# Altium project B152AA.PrjPcb
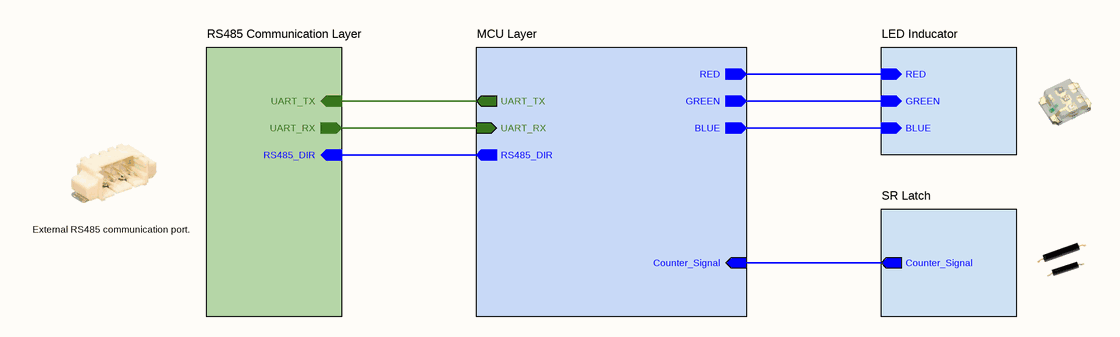
[diagram p0: Block_Diagram.SchDoc]
Address1_: Buyuk Kayacik Mah. 4. OSB; Address2_: 103. Cad. No : 12; Address3_: Selcuklu / Konya; Address4_: Türkiye; Copyright_: Copyright 2022 STF Tarim (Commercial Secret); Customer_: STF Irrigation; Engineer_: Gunce Akkoyun; Git_Repo_Address_: www.github.com/akkoyun/B152AA; Module_ID_: B152AA; Organization_: STF Res-Dev; Product_Desc_: P101DA; Product_ID_: P101DA; Revision_: 00.00.01; Version_: R1
5 sheets, 52 parts. Net scope: hierarchical (ports join the sheet entries above them; power ports are global).
Board file: B152AA.PcbDoc
Sheets:
  Block_Diagram.SchDoc
    RS485 Communication Layer = RS485 Communication Layer.SchDoc
    MCU Layer = MicroController.SchDoc
    SR Latch = SR Latch.SchDoc
    LED Inducator = LED Inducator.SchDoc

## Sheet Block_Diagram.SchDoc: B152AA Block Diagram
size 292 x 193 mm; SheetNumber: 1; SheetTotal: 5

### Sub-sheets
LED Inducator = LED Inducator.SchDoc: RED (in), BLUE (in), GREEN (in)
MCU Layer = MicroController.SchDoc: UART_TX (out), UART_RX (in), Counter_Signal (in), RS485_DIR (out), GREEN (out), RED (out), BLUE (out)
RS485 Communication Layer = RS485 Communication Layer.SchDoc: RS485_DIR (in), UART_RX (out), UART_TX (in)
SR Latch = SR Latch.SchDoc: Counter_Signal (out)

### Nets
BLUE: sheet MCU Layer/BLUE, sheet LED Inducator/BLUE
Counter_Signal: sheet MCU Layer/Counter_Signal, sheet SR Latch/Counter_Signal
GREEN: sheet MCU Layer/GREEN, sheet LED Inducator/GREEN
RED: sheet MCU Layer/RED, sheet LED Inducator/RED
RS485_DIR: sheet RS485 Communication Layer/RS485_DIR, sheet MCU Layer/RS485_DIR
UART_RX: sheet RS485 Communication Layer/UART_RX, sheet MCU Layer/UART_RX
UART_TX: sheet RS485 Communication Layer/UART_TX, sheet MCU Layer/UART_TX

### Notes on the sheet
- External RS485 communication port.
- © 2021 All rights reserved.
  This document may not, in whole or in part, be copied, photocopied, reproduced, translated or converted to any electronic or machine readable from without prior written permission of Mehmet Günce Akkoyun.
  Engineer contact : akkoyun@me.com
- Property of
- Engineer :
- Date :
- Size :
- A4
- Time :
- Project :
- Page :
- /
- Customer :
- Product ID :
- Module ID :
- Version :
- File :
- Revision :

## Sheet RS485 Communication Layer.SchDoc: RS485 Communication Layer
size 292 x 193 mm; SheetNumber: 2; SheetTotal: 5
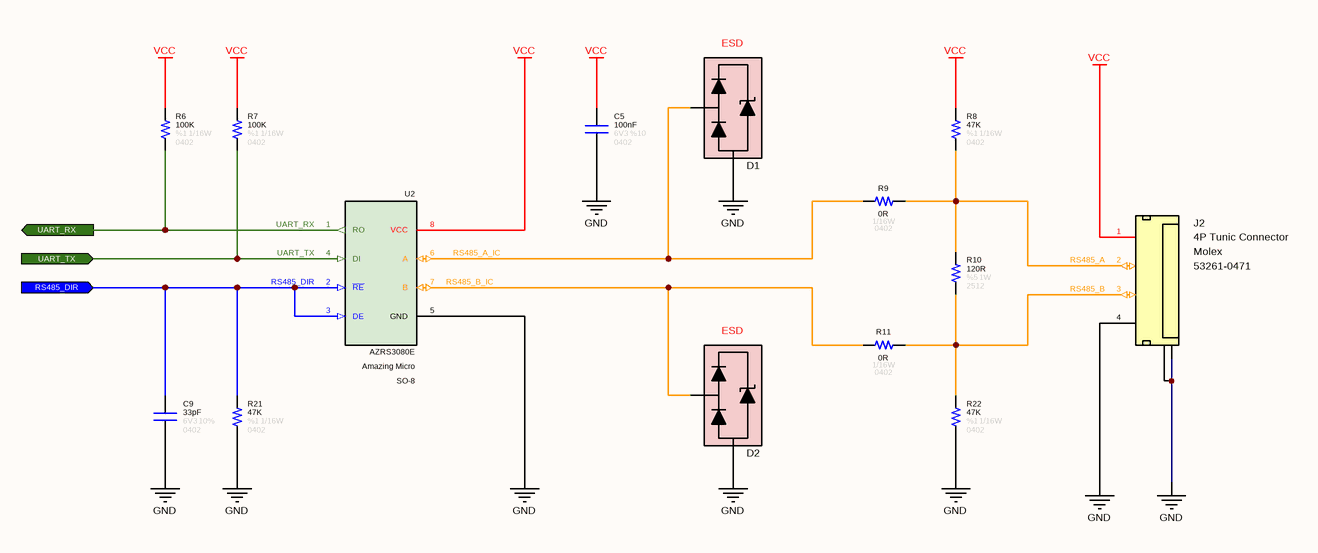
[diagram p1: RS485 Communication Layer.SchDoc]

### Parts
C5  value 100nF  Tolerance: %10  Voltage: 6V3  Case: 0402  [CAPACITOR_0402]  (hidden comment: Capacitor - 100nF [0402] (Ceramic))
C9  value 33pF  Tolerance: 10%  Case: 0402  Voltage: 6V3  [CAPACITOR_0402]  (hidden comment: Capacitor - 33pF [0402] (Ceramic))
D1  0402ESDA-MLP1  [ESD_0402]  (value not drawn)
D2  0402ESDA-MLP1  [ESD_0402]  (value not drawn)
J2  Manufacturer Name: Molex  Manufacturer Part Number: 53261-0471  [Connector_Tunic 4P]  (hidden comment: 4P SMD Tunic Connector)
R6  value 100K  Tolerance: %1  Case: 0402  Power: 1/16W  [RESISTOR_0402]  (hidden comment: 100K - 0402 - %1 - 1/16W)
R7  value 100K  Tolerance: %1  Case: 0402  Power: 1/16W  [RESISTOR_0402]  (hidden comment: 100K - 0402 - %1 - 1/16W)
R8  value 47K  Tolerance: %1  Case: 0402  Power: 1/16W  [RESISTOR_0402]  (hidden comment: 47K - 0402 - %1 - 1/16W)
R9  value 0R  Case: 0402  Power: 1/16W  [RESISTOR_0402]  (hidden comment: 0R - 0402 - %1 - 1/16W)
R10  value 120R  Tolerance: %5  Case: 2512  Power: 1W  [RESISTOR_2512]  (hidden comment: 120R - 2512 - %5 - 1W)
R11  value 0R  Case: 0402  Power: 1/16W  [RESISTOR_0402]  (hidden comment: 0R - 0402 - %1 - 1/16W)
R21  value 47K  Tolerance: %1  Case: 0402  Power: 1/16W  [RESISTOR_0402]  (hidden comment: 47K - 0402 - %1 - 1/16W)
R22  value 47K  Tolerance: %1  Case: 0402  Power: 1/16W  [RESISTOR_0402]  (hidden comment: 47K - 0402 - %1 - 1/16W)
U2  Case: SO-8  Manufacturer Part Number: AZRS3080E  Manufacturer Name: Amazing Micro  [SOP-8L (AZRS3080E)]  (hidden comment: RS485 Modulator)

### Ports
RS485_DIR (in), UART_RX (out), UART_TX (in)

### Nets
GND: C5.1 C9.1 D1.2(GND) D2.2(GND) J2.4(Pin-4) J2.5(GND) J2.6(GND) R21.1 R22.1 U2.5(GND)
VCC: C5.2 J2.1(Pin-1) R6.2 R7.2 R8.2 U2.8(VCC)
RS485_A: J2.2(Pin-2) R8.1 R9.1 R10.2
RS485_A_IC: D1.1(I/O) R9.2 U2.6(A)
RS485_B: J2.3(Pin-3) R10.1 R11.1 R22.2
RS485_B_IC: D2.1(I/O) R11.2 U2.7(B)
RS485_DIR: C9.2 R21.2 U2.2(~{RE}) U2.3(DE) ; port RS485_DIR
UART_RX: R6.1 U2.1(RO) ; port UART_RX
UART_TX: R7.1 U2.4(DI) ; port UART_TX

### Notes on the sheet
- © 2021 All rights reserved.
  This document may not, in whole or in part, be copied, photocopied, reproduced, translated or converted to any electronic or machine readable from without prior written permission of Mehmet Günce Akkoyun.
  Engineer contact : akkoyun@me.com
- Property of
- Engineer :
- Date :
- Size :
- A4
- Time :
- Project :
- Page :
- /
- Customer :
- Product ID :
- Module ID :
- Version :
- File :
- Revision :
- (in symbol Connector - Mini Tunic 4P (1.25)) 4P Tunic Connector
- (in symbol Diode - TPD1E05U06DPYR) ESD

### Library data of the parts
C5 = Capacitor - 100nF [0402-6V3]: Capacitor - 100nF [0402-6V3] (Ceramic); Manufacturer Name: AVX; Manufacturer Part Number: 04026D104KAT4A; ComponentLink1Description: Mouser; ComponentLink1URL: https://www.mouser.com.tr/ProductDetail/AVX/04026D104KAT4A?qs=sGAEpiMZZMs0AnBnWHyRQPg4iYkCw7IMED%2F4kpqgf7w%3D; ComponentLink2Description: DataSheet; ComponentLink2URL: https://www.mouser.com.tr/datasheet/2/40/cx5r-776519.pdf
C9 = Capacitor - 33pF [0402-6V3]: Manufacturer Name: Kemet; Manufacturer Part Number: C0402C330J9RACAUTO; ComponentLink1Description: DataSheet; ComponentLink1URL: https://api.kemet.com/component-edge/download/datasheet/C0402C330J9RACAUTO.pdf; ComponentLink2Description: Mouser; ComponentLink2URL: https://www.mouser.com/Search/Refine.aspx?Keyword=80-C0402C330J9RAUTO
D1 D2 = Diode - TPD1E05U06DPYR: SUPPRESSOR ESD 30VDC 0402 HFREE; Manufacturer Name: Eaton; Breakdown Voltage: 30V; Capacitance: 0.15pF; Manufacturer Part Number: 0402ESDA-MLP1; Case: 0402
J2 = Connector - Mini Tunic 4P (1.25): Mini Tunic Connector with 4P; Pitch: 1.25mm; Position: 4; ROHS: Yes; ComponentLink1Description: DataSheet; ComponentLink1URL: https://www.mouser.com.tr/datasheet/2/276/0532610471_PCB_HEADERS-170942.pdf; ComponentLink2Description: Mouser; ComponentLink2URL: https://www.mouser.com.tr/ProductDetail/Molex/53261-0471?qs=%2Fha2pyFaduhLhIsk8tywtK7BwWtguBSP4XxyDBTOTfs%3D; Case: SMD
R6 R7 = Resistor - 100K [0402]: Thick Film Resistors - SMD 1/16 W 100 KOhm 1%; Manufacturer Name: Vishay; Manufacturer Part Number: CRCW0402100KFKED; ComponentLink1Description: DataSheet; ComponentLink1URL: https://www.mouser.com.tr/datasheet/2/427/dcrcwe3-1762152.pdf; ComponentLink2Description: Mouser; ComponentLink2URL: https://www.mouser.com.tr/ProductDetail/Vishay-Dale/CRCW040210K0FKED?qs=sGAEpiMZZMu61qfTUdNhG2DpbjADlD3GcalbOv9utCY%3D
R8 R21 R22 = Resistor - 47K [0402]: Thick Film Resistors - SMD 1/16 W 47 KOhm 1%; Manufacturer Name: Vishay; Manufacturer Part Number: CRCW040247K0FKED; ComponentLink1Description: DataSheet; ComponentLink1URL: https://www.mouser.com.tr/datasheet/2/427/dcrcwe3-1762152.pdf; ComponentLink2Description: Mouser; ComponentLink2URL: https://www.mouser.com.tr/ProductDetail/Vishay-Dale/CRCW040247K0FKED?qs=sGAEpiMZZMu61qfTUdNhG2DpbjADlD3GL%252B3h1elTxqU%3D
R9 R11 = Resistor - 0R [0402]: Thick Film Resistors - SMD 1/16 W 0 Ohm; Manufacturer Name: Vishay; Manufacturer Part Number: CRCW04020000Z0ED; ComponentLink1Description: DataSheet; ComponentLink1URL: https://www.mouser.com.tr/datasheet/2/427/dcrcwe3-1762152.pdf; ComponentLink2Description: Mouser; ComponentLink2URL: https://www.mouser.com.tr/ProductDetail/Vishay-Dale/CRCW04020000Z0ED?qs=sGAEpiMZZMu61qfTUdNhG2DpbjADlD3GG34cJb50zyg%3D
R10 = Resistor - 120R [2512]: Thick Film Resistors - SMD 1 W 120 Ohm 5%; Manufacturer Name: YAGEO; Manufacturer Part Number: RC2512JK-07120RL; ComponentLink1Description: DataSheet; ComponentLink1URL: https://www.mouser.com.tr/datasheet/2/447/PYu_RC_Group_51_RoHS_L_11-1984063.pdf
U2 = IC - AZRS3080E: Half-duplex RS485 transceiver.; RoHS: Yes; ComponentLink1Description: DataSheet; ComponentLink1URL: https://www.amazingic.com/common/frontend/download?path=/uploads/images/products/PDF/AZRS/AZRS3080E.pdf

## Sheet MicroController.SchDoc: MicroController
size 292 x 193 mm; SheetNumber: 3; SheetTotal: 5
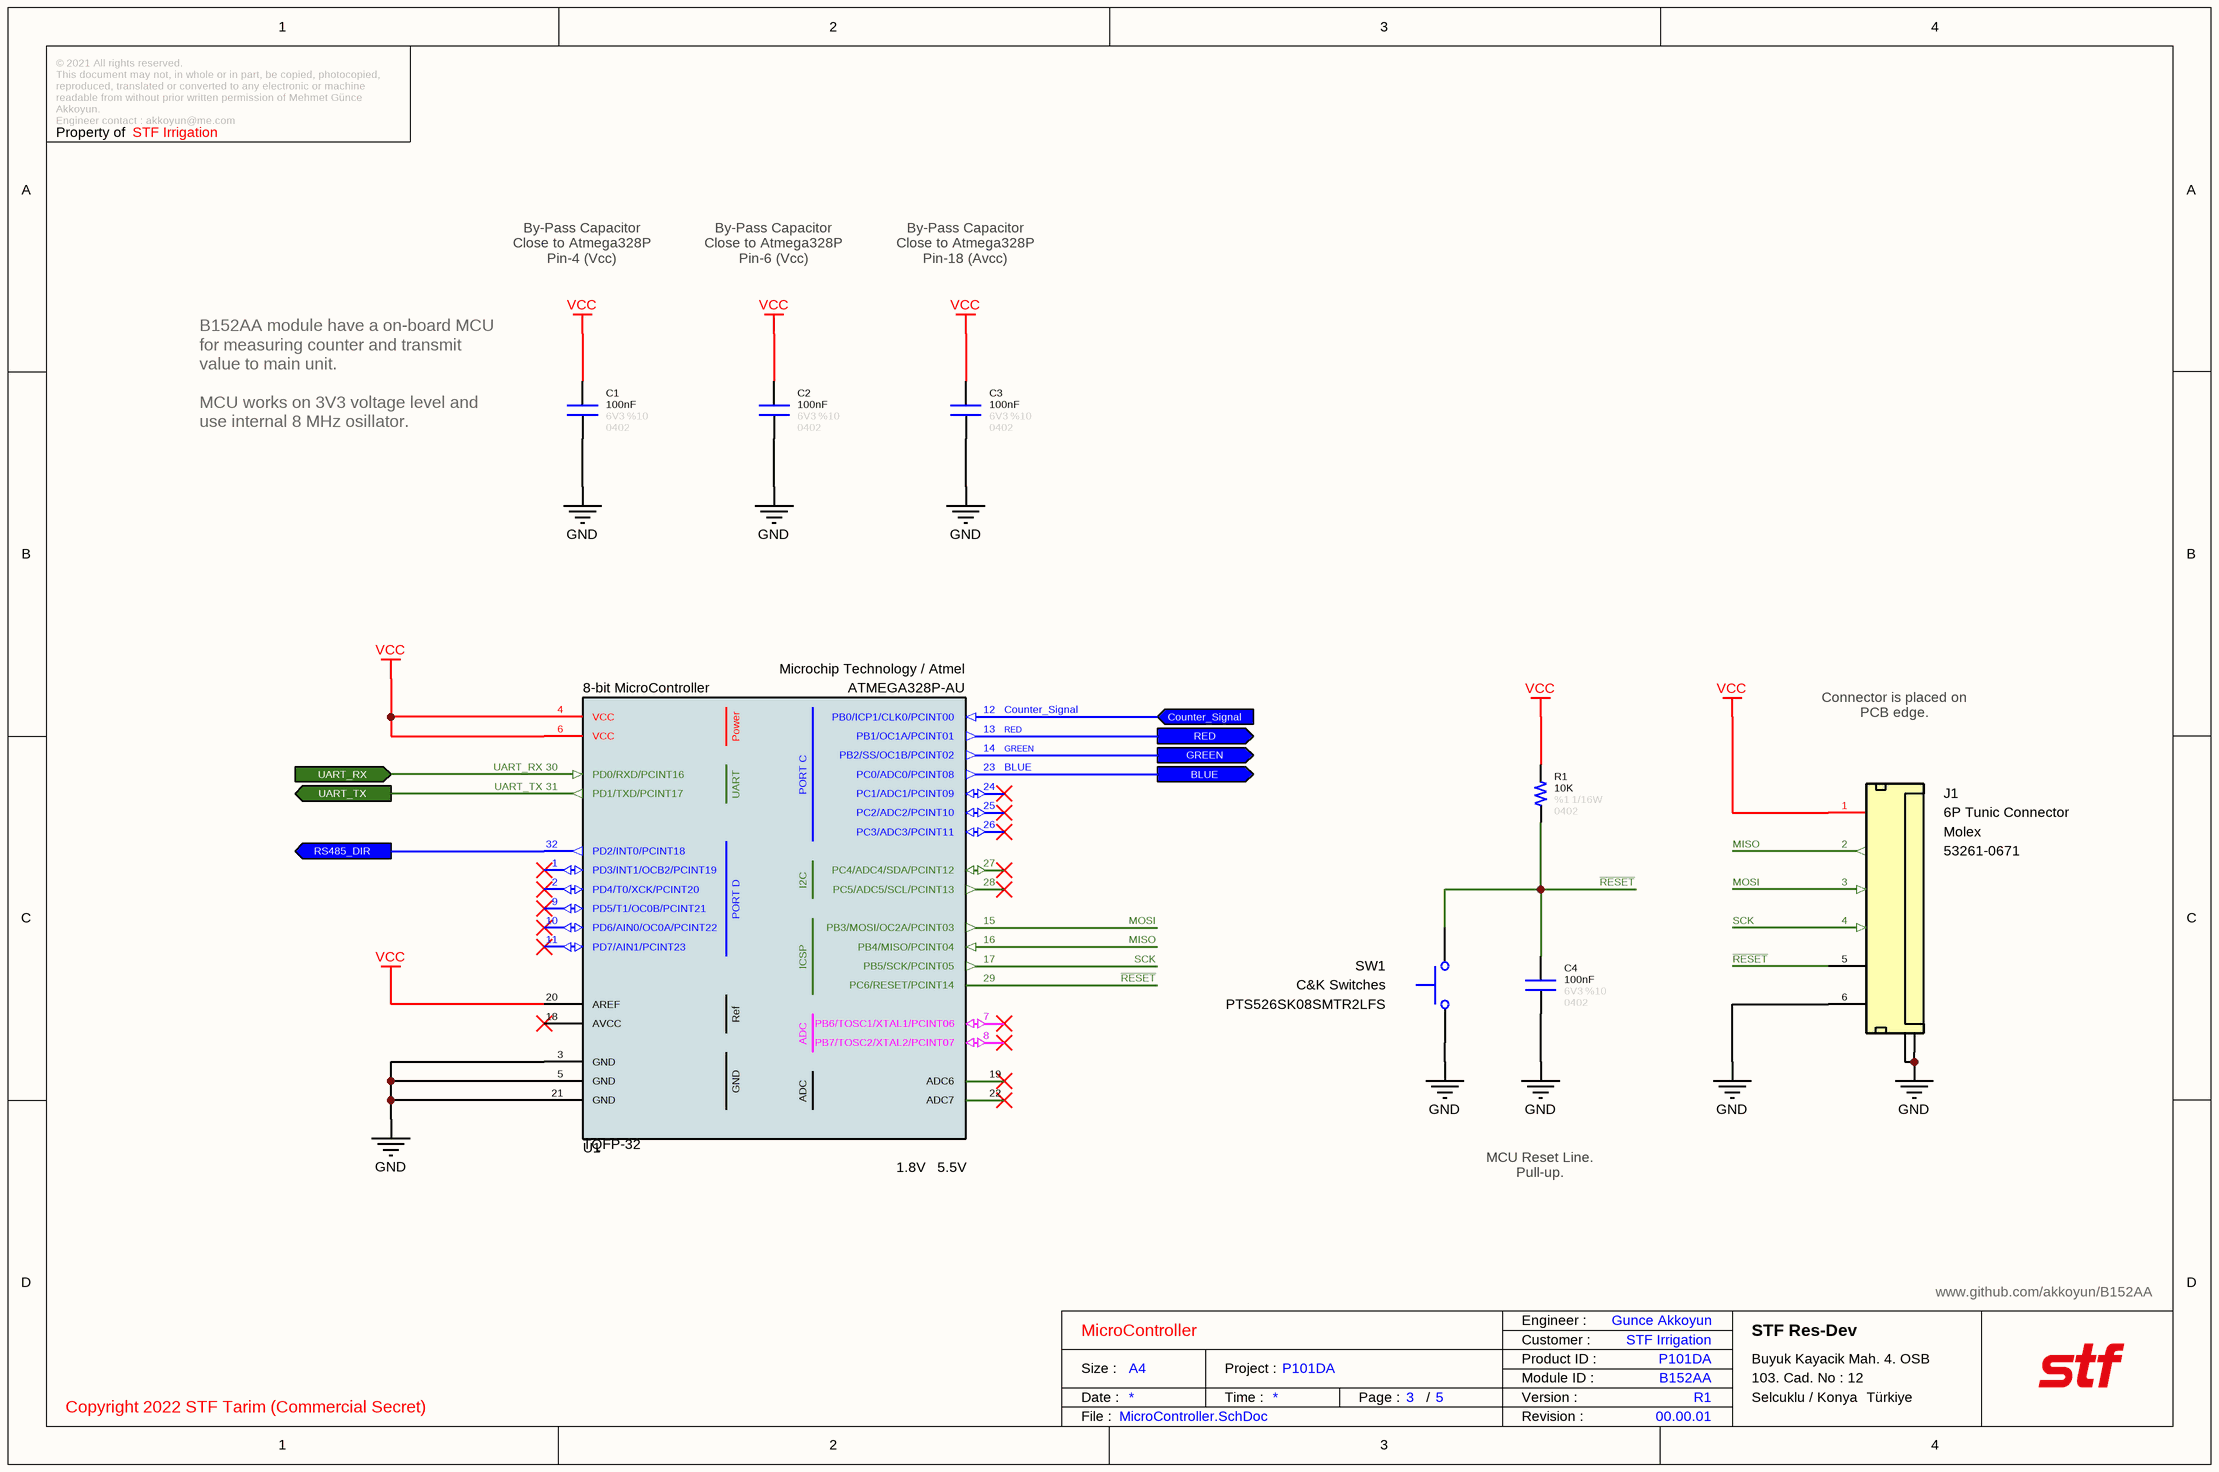
[diagram p2: MicroController.SchDoc]

### Parts
C1  value 100nF  Tolerance: %10  Voltage: 6V3  Case: 0402  [CAPACITOR_0402]  (hidden comment: Capacitor - 100nF [0402] (Ceramic))
C2  value 100nF  Tolerance: %10  Voltage: 6V3  Case: 0402  [CAPACITOR_0402]  (hidden comment: Capacitor - 100nF [0402] (Ceramic))
C3  value 100nF  Tolerance: %10  Voltage: 6V3  Case: 0402  [CAPACITOR_0402]  (hidden comment: Capacitor - 100nF [0402] (Ceramic))
C4  value 100nF  Tolerance: %10  Voltage: 6V3  Case: 0402  [CAPACITOR_0402]  (hidden comment: Capacitor - 100nF [0402] (Ceramic))
J1  6P Tunic Connector  Manufacturer Part Number: 53261-0671  Manufacturer Name: Molex  [Connector_Tunic 6P]
R1  value 10K  Tolerance: %1  Case: 0402  Power: 1/16W  [RESISTOR_0402]  (hidden comment: 10K - 0402 - %1 - 1/16W)
SW1  Manufacturer Name: C&K Switches  [PTS526_Switch]  (hidden comment: PTS526SK08SMTR2LFS)
U1  8-bit MicroController  Supply Voltage - Max: 5.5V  Supply Voltage - Min: 1.8V  Manufacturer Name: Microchip Technology / Atmel  Manufacturer Part Number: ATMEGA328P-AU  Case: TQFP-32  [TQFN-32]

### Ports
BLUE (out), Counter_Signal (in), GREEN (out), RED (out), RS485_DIR (out), UART_RX (in), UART_TX (out)

### Nets
GND: C1.1 C2.1 C3.1 C4.1 J1.6(GND) J1.7(GND) J1.8(GND) SW1.1(NC) U1.3(GND) U1.5(GND) U1.21(GND)
VCC: C1.2 C2.2 C3.2 J1.1(VCC) R1.2 U1.4(VCC) U1.6(VCC) U1.20(AREF)
BLUE: U1.23(PC0/ADC0/PCINT08) ; port BLUE
Counter_Signal: U1.12(PB0/ICP1/CLK0/PCINT00) ; port Counter_Signal
GREEN: U1.14(PB2/SS/OC1B/PCINT02) ; port GREEN
MISO: J1.2(MISO) U1.16(PB4/MISO/PCINT04)
MOSI: J1.3(MOSI) U1.15(PB3/MOSI/OC2A/PCINT03)
~{RESET}: C4.2 J1.5(RESET) R1.1 SW1.2(COM) U1.29(PC6/RESET/PCINT14)
RED: U1.13(PB1/OC1A/PCINT01) ; port RED
RS485_DIR: U1.32(PD2/INT0/PCINT18) ; port RS485_DIR
SCK: J1.4(SCK) U1.17(PB5/SCK/PCINT05)
UART_RX: U1.30(PD0/RXD/PCINT16) ; port UART_RX
UART_TX: U1.31(PD1/TXD/PCINT17) ; port UART_TX

Not connected (* = marked no-connect by the designer): U1 1(PD3/INT1/OCB2/PCINT19)* 2(PD4/T0/XCK/PCINT20)* 7(PB6/TOSC1/XTAL1/PCINT06)* 8(PB7/TOSC2/XTAL2/PCINT07)* 9(PD5/T1/OC0B/PCINT21)* 10(PD6/AIN0/OC0A/PCINT22)* 11(PD7/AIN1/PCINT23)* 18(AVCC)* 19(ADC6)* 22(ADC7)* 24(PC1/ADC1/PCINT09)* 25(PC2/ADC2/PCINT10)* 26(PC3/ADC3/PCINT11)* 27(PC4/ADC4/SDA/PCINT12)* 28(PC5/ADC5/SCL/PCINT13)*

### Notes on the sheet
- By-Pass Capacitor
  Close to Atmega328P
  Pin-4 (Vcc)
- By-Pass Capacitor
  Close to Atmega328P
  Pin-6 (Vcc)
- By-Pass Capacitor
  Close to Atmega328P
  Pin-18 (Avcc)
- B152AA module have a on-board MCU for measuring counter and transmit value to main unit.
  MCU works on 3V3 voltage level and use internal 8 MHz osillator.
- Connector is placed on PCB edge.
- MCU Reset Line. Pull-up.
- © 2021 All rights reserved.
  This document may not, in whole or in part, be copied, photocopied, reproduced, translated or converted to any electronic or machine readable from without prior written permission of Mehmet Günce Akkoyun.
  Engineer contact : akkoyun@me.com
- Property of
- Engineer :
- Date :
- Size :
- A4
- Time :
- Project :
- Page :
- /
- Customer :
- Product ID :
- Module ID :
- Version :
- File :
- Revision :
- (in symbol IC - ATMEGA328P-AU) Power; PORT C; UART; I2C; PORT D; ICSP; Ref; ADC

### Library data of the parts
C1-C4 = Capacitor - 100nF [0402-6V3]: as C5 on sheet RS485 Communication Layer; ComponentLink1Description: Mouser; ComponentLink1URL: https://www.mouser.com.tr/ProductDetail/AVX/04026D104KAT4A?qs=sGAEpiMZZMs0AnBnWHyRQPg4iYkCw7IMED%2F4kpqgf7w%3D; ComponentLink2Description: DataSheet; ComponentLink2URL: https://www.mouser.com.tr/datasheet/2/40/cx5r-776519.pdf
J1 = Connector - Mini Tunic 6P (1.25): Mini Tunic Connector with 6P; ROHS: Yes
R1 = Resistor - 10K [0402]: Thick Film Resistors - SMD 1/16 W 10 KOhm 1%; Manufacturer Name: Vishay; Manufacturer Part Number: CRCW040210K0FKED; ComponentLink1Description: DataSheet; ComponentLink1URL: https://www.mouser.com.tr/datasheet/2/427/dcrcwe3-1762152.pdf; ComponentLink2Description: Mouser; ComponentLink2URL: https://www.mouser.com.tr/ProductDetail/Vishay-Dale/CRCW040210K0FKED?qs=sGAEpiMZZMu61qfTUdNhG2DpbjADlD3GcalbOv9utCY%3D
SW1 = Switch - Push Button: Switch Tactile N.O. SPST Flush Round Button Gull Wing 0.05A 12VDC 200000Cycles 2.45N SMD T/R; Current Rating: 50 mA; Contact Form: SPST; Product Type: Tactile Switches; RoHS: Yes; Voltage Rating: 12 VDC; Case: SMD; Manufacturer Part Number: PTS526SK08SMTR2LFS
U1 = IC - ATMEGA328P-AU: 8-bit Microcontrollers - MCU 32KB In-system Flash 20MHz 1.8V-5.5V; Height: 1mm; ComponentLink1Description: DataSheet; ComponentLink1URL: http://ww1.microchip.com/downloads/en/DeviceDoc/ATmega48A-PA-88A-PA-168A-PA-328-P-DS-DS40002061A.pdf; ROHS: Yes; Minimum Operating Temperature: -40; Maximum Operating Temperature: +85; ComponentLink2Description: Mouser; ComponentLink2URL: https://www.mouser.com.tr/ProductDetail/Microchip-Technology-Atmel/ATMEGA328P-AU?qs=sGAEpiMZZMtVoztFdqDXO3RbBx7FKCmV; ComponentLink3Description: ProductPage; ComponentLink3URL: https://www.microchip.com/wwwproducts/en/ATmega328p

## Sheet SR Latch.SchDoc: SR Latch
size 292 x 193 mm; SheetNumber: 5; SheetTotal: 5
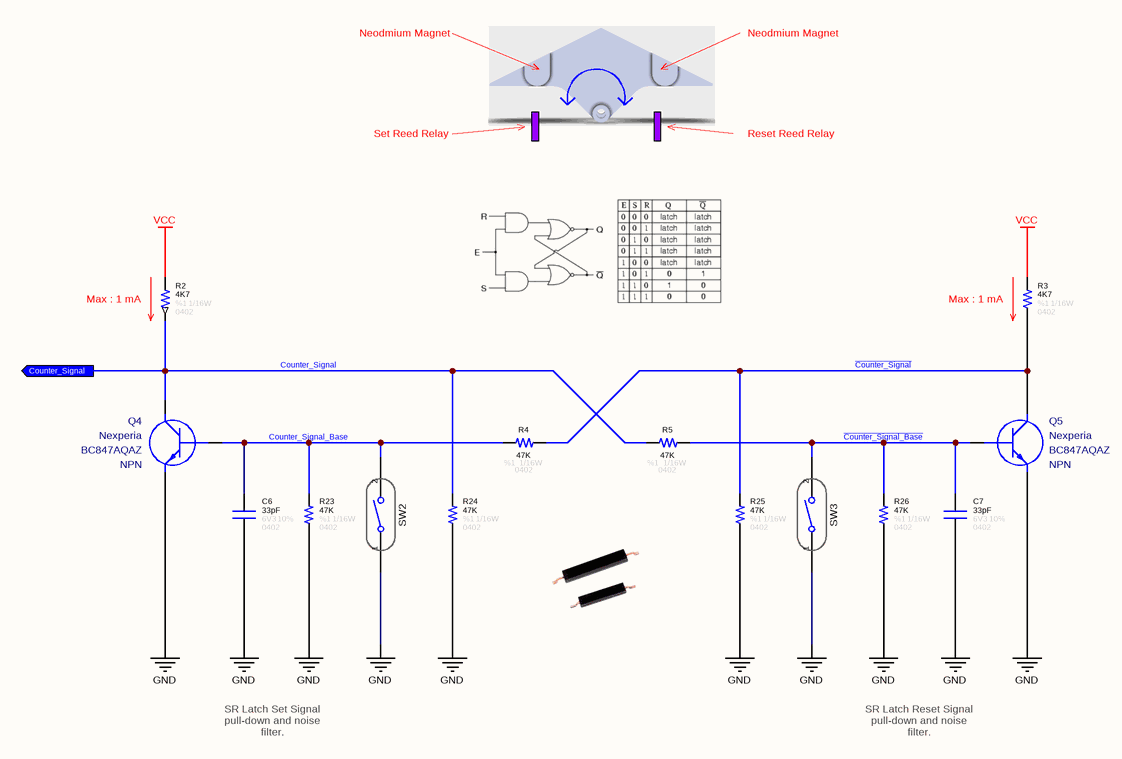
[diagram p3: SR Latch.SchDoc]

### Parts
C6  value 33pF  Tolerance: 10%  Case: 0402  Voltage: 6V3  [CAPACITOR_0402]  (hidden comment: Capacitor - 33pF [0402] (Ceramic))
C7  value 33pF  Tolerance: 10%  Case: 0402  Voltage: 6V3  [CAPACITOR_0402]  (hidden comment: Capacitor - 33pF [0402] (Ceramic))
Q4  Manufacturer Name: Nexperia  Polarity: NPN  [SOT1215]  (hidden comment: BC847AQAZ)
Q5  Manufacturer Name: Nexperia  Polarity: NPN  [SOT1215]  (hidden comment: BC847AQAZ)
R2  value 4K7  Tolerance: %1  Case: 0402  Power: 1/16W  [RESISTOR_0402]  (hidden comment: 4K7 - 0402 - %1 - 1/16W)
R3  value 4K7  Tolerance: %1  Case: 0402  Power: 1/16W  [RESISTOR_0402]  (hidden comment: 4K7 - 0402 - %1 - 1/16W)
R4  value 47K  Tolerance: %1  Case: 0402  Power: 1/16W  [RESISTOR_0402]  (hidden comment: 47K - 0402 - %1 - 1/16W)
R5  value 47K  Tolerance: %1  Case: 0402  Power: 1/16W  [RESISTOR_0402]  (hidden comment: 47K - 0402 - %1 - 1/16W)
R23  value 47K  Tolerance: %1  Case: 0402  Power: 1/16W  [RESISTOR_0402]  (hidden comment: 47K - 0402 - %1 - 1/16W)
R24  value 47K  Tolerance: %1  Case: 0402  Power: 1/16W  [RESISTOR_0402]  (hidden comment: 47K - 0402 - %1 - 1/16W)
R25  value 47K  Tolerance: %1  Case: 0402  Power: 1/16W  [RESISTOR_0402]  (hidden comment: 47K - 0402 - %1 - 1/16W)
R26  value 47K  Tolerance: %1  Case: 0402  Power: 1/16W  [RESISTOR_0402]  (hidden comment: 47K - 0402 - %1 - 1/16W)
SW2  Reed Relay  [REED Relay]  (value not drawn)
SW3  Reed Relay  [REED Relay]  (value not drawn)

### Ports
Counter_Signal (out)

### Nets
GND: C6.1 C7.1 Q4.2(E) Q5.2(E) R23.1 R24.1 R25.1 R26.1 SW2.1(NC) SW3.1(NC)
VCC: R2.2 R3.2
~{Counter_Signal}: Q5.3(C) R3.1 R4.1 R25.2
~{Counter_Signal_Base}: C7.2 Q5.1(B) R5.1 R26.2 SW3.2(COM)
Counter_Signal: Q4.3(C) R2.1 R5.2 R24.2 ; port Counter_Signal
Counter_Signal_Base: C6.2 Q4.1(B) R4.2 R23.2 SW2.2(COM)

### Notes on the sheet
- Neodmium Magnet
- Set Reed Relay
- Reset Reed Relay
- (near R2) Max : 1 mA
- (near R3) Max : 1 mA
- SR Latch Set Signal pull-down and noise filter.
- SR Latch Reset Signal pull-down and noise filter.
- © 2021 All rights reserved.
  This document may not, in whole or in part, be copied, photocopied, reproduced, translated or converted to any electronic or machine readable from without prior written permission of Mehmet Günce Akkoyun.
  Engineer contact : akkoyun@me.com
- Property of
- Engineer :
- Date :
- Size :
- A4
- Time :
- Project :
- Page :
- /
- Customer :
- Product ID :
- Module ID :
- Version :
- File :
- Revision :

### Library data of the parts
C6 C7 = Capacitor - 33pF [0402-6V3]: as C9 on sheet RS485 Communication Layer; ComponentLink1Description: DataSheet; ComponentLink1URL: https://api.kemet.com/component-edge/download/datasheet/C0402C330J9RACAUTO.pdf; ComponentLink2Description: Mouser; ComponentLink2URL: https://www.mouser.com/Search/Refine.aspx?Keyword=80-C0402C330J9RAUTO
Q4 Q5 = Transistor - BC847: Bipolar NPN Transistors; Case: DFN-1010D-3; Manufacturer Part Number: BC847AQAZ
R2 R3 = Resistor - 4K7 [0402]: Thick Film Resistors - SMD 1/16 W 4.7 KOhm 1%; Manufacturer Name: Vishay; Manufacturer Part Number: CRCW04024K70FKED; ComponentLink1Description: DataSheet; ComponentLink1URL: https://www.mouser.com.tr/datasheet/2/427/dcrcwe3-1762152.pdf; ComponentLink2Description: Mouser; ComponentLink2URL: https://www.mouser.com.tr/ProductDetail/Vishay-Dale/CRCW04024K70FKED?qs=sGAEpiMZZMu61qfTUdNhG7nHf%2F6MTUn3HadIdDQu24Q%3D
R4 R5 R23-R26 = Resistor - 47K [0402]: as R8 on sheet RS485 Communication Layer; ComponentLink1Description: DataSheet; ComponentLink1URL: https://www.mouser.com.tr/datasheet/2/427/dcrcwe3-1762152.pdf; ComponentLink2Description: Mouser; ComponentLink2URL: https://www.mouser.com.tr/ProductDetail/Vishay-Dale/CRCW040247K0FKED?qs=sGAEpiMZZMu61qfTUdNhG2DpbjADlD3GL%252B3h1elTxqU%3D
SW2 SW3 = Switch - Reed Relay: Reed relay - SMD 11.7 mm; Manufacturer Name: Ryazan Metal Ceramic; Manufacturer Part Number: MKA-10110MS; Height: 3mm

## Sheet LED Inducator.SchDoc: MCU LED Layer
size 292 x 193 mm; SheetNumber: 4; SheetTotal: 5
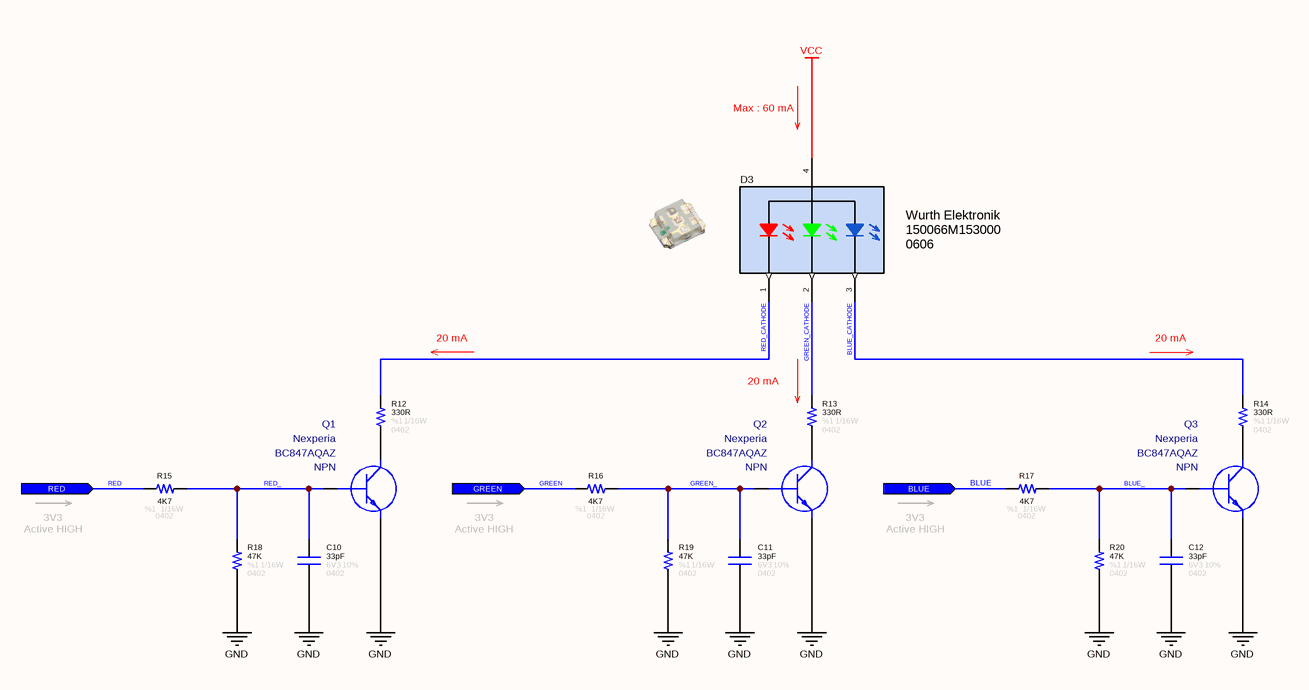
[diagram p4: LED Inducator.SchDoc]

### Parts
C10  value 33pF  Tolerance: 10%  Case: 0402  Voltage: 6V3  [CAPACITOR_0402]  (hidden comment: Capacitor - 33pF [0402] (Ceramic))
C11  value 33pF  Tolerance: 10%  Case: 0402  Voltage: 6V3  [CAPACITOR_0402]  (hidden comment: Capacitor - 33pF [0402] (Ceramic))
C12  value 33pF  Tolerance: 10%  Case: 0402  Voltage: 6V3  [CAPACITOR_0402]  (hidden comment: Capacitor - 33pF [0402] (Ceramic))
D3  Manufacturer Name: Wurth Elektronik  Case: 0606  [Wurth_0606]  (hidden comment: 150066M153000)
Q1  Manufacturer Name: Nexperia  Polarity: NPN  [SOT1215]  (hidden comment: BC847AQAZ)
Q2  Manufacturer Name: Nexperia  Polarity: NPN  [SOT1215]  (hidden comment: BC847AQAZ)
Q3  Manufacturer Name: Nexperia  Polarity: NPN  [SOT1215]  (hidden comment: BC847AQAZ)
R12  value 330R  Case: 0402  Tolerance: %1  Power: 1/16W  [RESISTOR_0402]  (hidden comment: 330R - 0402 - %1 - 1/16W)
R13  value 330R  Case: 0402  Tolerance: %1  Power: 1/16W  [RESISTOR_0402]  (hidden comment: 330R - 0402 - %1 - 1/16W)
R14  value 330R  Case: 0402  Tolerance: %1  Power: 1/16W  [RESISTOR_0402]  (hidden comment: 330R - 0402 - %1 - 1/16W)
R15  value 4K7  Tolerance: %1  Case: 0402  Power: 1/16W  [RESISTOR_0402]  (hidden comment: 4K7 - 0402 - %1 - 1/16W)
R16  value 4K7  Tolerance: %1  Case: 0402  Power: 1/16W  [RESISTOR_0402]  (hidden comment: 4K7 - 0402 - %1 - 1/16W)
R17  value 4K7  Tolerance: %1  Case: 0402  Power: 1/16W  [RESISTOR_0402]  (hidden comment: 4K7 - 0402 - %1 - 1/16W)
R18  value 47K  Tolerance: %1  Case: 0402  Power: 1/16W  [RESISTOR_0402]  (hidden comment: 47K - 0402 - %1 - 1/16W)
R19  value 47K  Tolerance: %1  Case: 0402  Power: 1/16W  [RESISTOR_0402]  (hidden comment: 47K - 0402 - %1 - 1/16W)
R20  value 47K  Tolerance: %1  Case: 0402  Power: 1/16W  [RESISTOR_0402]  (hidden comment: 47K - 0402 - %1 - 1/16W)

### Ports
BLUE (in), GREEN (in), RED (in)

### Nets
GND: C10.1 C11.1 C12.1 Q1.2(E) Q2.2(E) Q3.2(E) R18.1 R19.1 R20.1
VCC: D3.4
BLUE: R17.2 ; port BLUE
BLUE_: C12.2 Q3.1(B) R17.1 R20.2
BLUE_CATHODE: D3.3 R14.2
GREEN: R16.2 ; port GREEN
GREEN_: C11.2 Q2.1(B) R16.1 R19.2
GREEN_CATHODE: D3.2 R13.2
RED: R15.2 ; port RED
RED_: C10.2 Q1.1(B) R15.1 R18.2
RED_CATHODE: D3.1 R12.2
NetQ1_3: Q1.3(C) R12.1
NetQ2_3: Q2.3(C) R13.1
NetQ3_3: Q3.3(C) R14.1

### Notes on the sheet
- Max : 60 mA
- 20 mA
- (near R13) 20 mA
- 3V3
  Active HIGH
- © 2021 All rights reserved.
  This document may not, in whole or in part, be copied, photocopied, reproduced, translated or converted to any electronic or machine readable from without prior written permission of Mehmet Günce Akkoyun.
  Engineer contact : akkoyun@me.com
- Property of
- Engineer :
- Date :
- Size :
- A4
- Time :
- Project :
- Page :
- /
- Customer :
- Product ID :
- Module ID :
- Version :
- File :
- Revision :

### Library data of the parts
C10-C12 = Capacitor - 33pF [0402-6V3]: as C9 on sheet RS485 Communication Layer; ComponentLink1Description: DataSheet; ComponentLink1URL: https://api.kemet.com/component-edge/download/datasheet/C0402C330J9RACAUTO.pdf; ComponentLink2Description: Mouser; ComponentLink2URL: https://www.mouser.com/Search/Refine.aspx?Keyword=80-C0402C330J9RAUTO
D3 = Diode - LED-RGB: LED RGB DIFFUSED SMD; If - Forward Current: 20 mA; Vf - Forward Voltage: 2 V, 3.3 V; Product Type: LED; Minimum Operating Temperature: - 40 C; Maximum Operating Temperature: + 85 C; ROHS: Yes; Manufacturer Part Number: 150066M153000
Q1-Q3 = Transistor - BC847: Bipolar NPN Transistors; Case: DFN-1010D-3; Manufacturer Part Number: BC847AQAZ
R12-R14 = Resistor - 330R [0402]: Thick Film Resistors - SMD 1/16 W 330 Ohm 1%; Manufacturer Name: Vishay; Manufacturer Part Number: CRCW0402330RFKED; ComponentLink1Description: DataSheet; ComponentLink1URL: https://www.mouser.com.tr/datasheet/2/427/dcrcwe3-1762152.pdf; ComponentLink2Description: Mouser; ComponentLink2URL: https://www.mouser.com.tr/ProductDetail/Vishay-Dale/CRCW0402330RFKED?qs=sGAEpiMZZMu61qfTUdNhG2DpbjADlD3GGS6SwBlLi5Q%3D
R15-R17 = Resistor - 4K7 [0402]: as R2 on sheet SR Latch; ComponentLink1Description: DataSheet; ComponentLink1URL: https://www.mouser.com.tr/datasheet/2/427/dcrcwe3-1762152.pdf; ComponentLink2Description: Mouser; ComponentLink2URL: https://www.mouser.com.tr/ProductDetail/Vishay-Dale/CRCW04024K70FKED?qs=sGAEpiMZZMu61qfTUdNhG7nHf%2F6MTUn3HadIdDQu24Q%3D
R18-R20 = Resistor - 47K [0402]: as R8 on sheet RS485 Communication Layer; ComponentLink1Description: DataSheet; ComponentLink1URL: https://www.mouser.com.tr/datasheet/2/427/dcrcwe3-1762152.pdf; ComponentLink2Description: Mouser; ComponentLink2URL: https://www.mouser.com.tr/ProductDetail/Vishay-Dale/CRCW040247K0FKED?qs=sGAEpiMZZMu61qfTUdNhG2DpbjADlD3GL%252B3h1elTxqU%3D

## Nets that join several sheets
GND: RS485 Communication Layer (10 pins), MicroController (11 pins), SR Latch (10 pins), LED Inducator (9 pins)
VCC: RS485 Communication Layer (6 pins), MicroController (8 pins), SR Latch (R2.2 R3.2), LED Inducator (D3.4)
BLUE: MicroController (U1.23), LED Inducator (R17.2)
Counter_Signal: MicroController (U1.12), SR Latch (Q4.3 R2.1 R5.2 R24.2)
GREEN: MicroController (U1.14), LED Inducator (R16.2)
RED: MicroController (U1.13), LED Inducator (R15.2)
RS485_DIR: RS485 Communication Layer (C9.2 R21.2 U2.2 U2.3), MicroController (U1.32)
UART_RX: RS485 Communication Layer (R6.1 U2.1), MicroController (U1.30)
UART_TX: RS485 Communication Layer (R7.1 U2.4), MicroController (U1.31)

## Assembly variants
B152AB: not fitted C10 C11 C12 D1 D2 D3 Q1 Q2 Q3 R12 R13 R14 R15 R16 R17 R18 R19 R20 SW1